# Altium schematic sheet Prueba1.SchDoc
size Letter; Author: Pablo F. Moreno L.; SheetNumber: 1
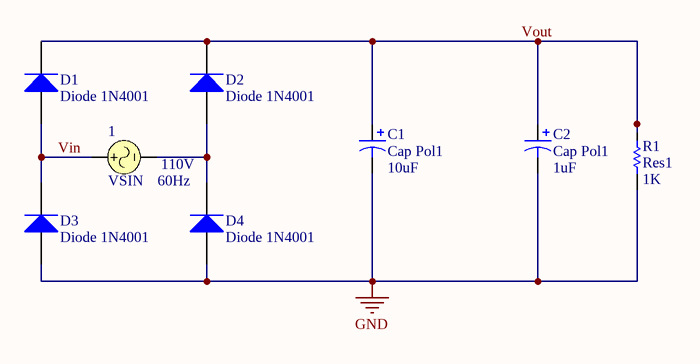
[diagram p0: Prueba1.SchDoc]

## Parts
1  VSIN  Amplitude: 110V  Frequency: 60Hz
C1  Cap Pol1  value 10uF  [RB7.6-15]
C2  Cap Pol1  value 1uF  [RB7.6-15]
D1  Diode 1N4001  [DO-41]
D2  Diode 1N4001  [DO-41]
D3  Diode 1N4001  [DO-41]
D4  Diode 1N4001  [DO-41]
R1  Res1  value 1K  [AXIAL-0.3]

## Nets
GND: C1.2 C2.2 D3.1(A) D4.1(A) R1.1
Vin: 1.1 D1.1(A) D3.2(K)
Vout: C1.1 C2.1 D1.2(K) D2.2(K) R1.2
Net1_2: 1.2 D2.1(A) D4.2(K)

## Notes on the sheet
- Project:
- Page content:
- Size:
- Revisión
- Letter
- Document Number
- Design:
- Date:
- Sheet:
- of

## Library data of the parts
1 = VSIN: Sinusoidal Voltage Source; Note: PCB Footprint - Not required; Published: 8-Jun-2000; LatestRevisionDate: 15-Nov-2004; LatestRevisionNote: Corrected Netlist.; PackageReference: Not Applicable; Publisher: Altium Limited
C1 C2 = Cap Pol1: Polarized Capacitor (Radial); Published: 8-Jun-2000; LatestRevisionDate: 17-Jul-2002; LatestRevisionNote: Re-released for DXP Platform.; PackageReference: RB7.6-15; Publisher: Altium Limited; PackageDescription: Polarized Capacitor (Radial); 2 Leads
D1-D4 = Diode 1N4001: 1 Amp General Purpose Rectifier; Published: 8-Jun-2000; LatestRevisionDate: 17-Jul-2002; LatestRevisionNote: Re-released for DXP Platform.; DatasheetVersion: 1998; PackageVersion: Aug-1999; PackageReference: DO-41; Publisher: Altium Limited; PackageDescription: Diode, Axial; Body 5.2 x 2.7 mm (LxDia. max), Lead Dia. 0.86 mm (max); Code_JEDEC: DO-204-AL; ComponentLink1Description: Manufacturer Link; ComponentLink1URL: http://www.fairchildsemi.com/; ComponentLink2Description: Datasheet; ComponentLink2URL: http://www.fairchildsemi.com/ds/1N%2F1N4001.pdf
R1 = Res1: Resistor; Published: 8-Jun-2000; LatestRevisionDate: 17-Jul-2002; LatestRevisionNote: Re-released for DXP Platform.; PackageReference: AXIAL-0.3; Publisher: Altium Limited; PackageDescription: Axial Device, Thru-Hole; 2 Leads; 0.3 in Pin Spacing